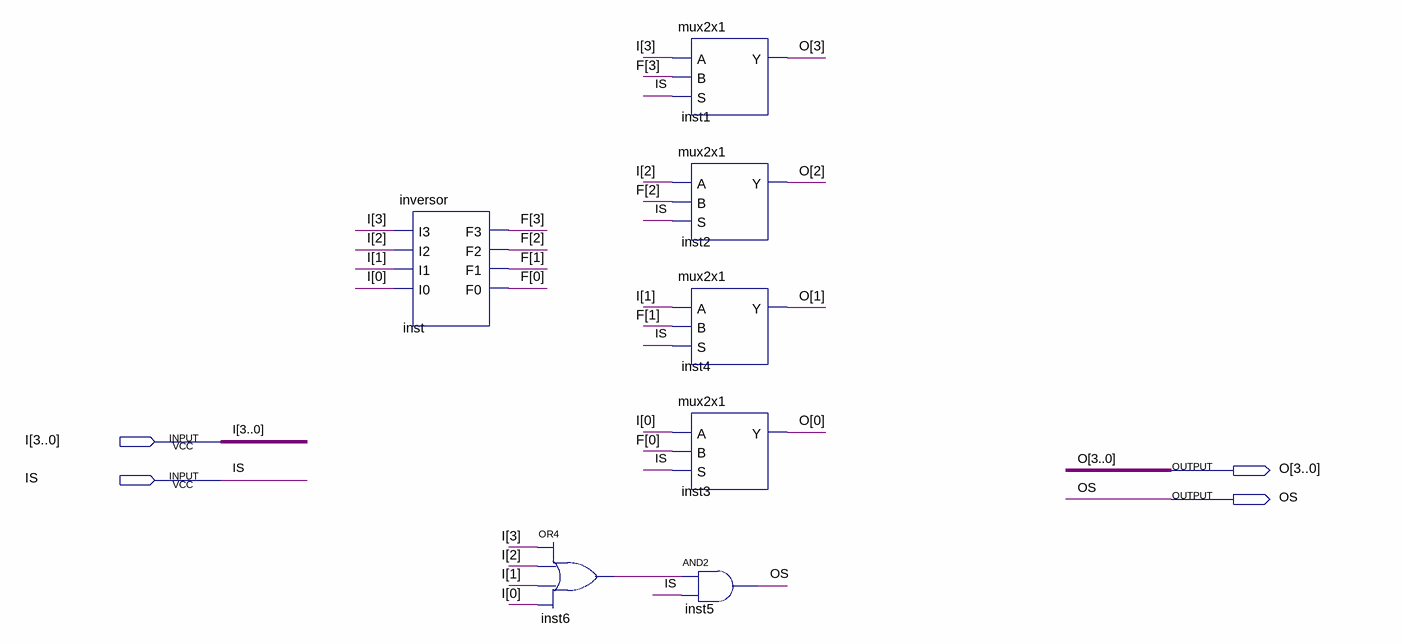
[diagram p0: schematic sheet]
// Quartus schematic comp2.bdf as structural Verilog: 7 symbols, 4 pins
module comp2 (
  input  [3:0] I,
  input  IS,
  output [3:0] O,
  output OS
);

  wire inst6_out;
  wire [3:0] F;

  inversor inst (.I3(I[3]), .I2(I[2]), .I1(I[1]), .I0(I[0]), .F3(F[3]), .F2(F[2]), .F1(F[1]), .F0(F[0]));
  or inst6 (inst6_out, I[3], I[2], I[1], I[0]);
  mux2x1 inst1 (.A(I[3]), .B(F[3]), .S(IS), .Y(O[3]));
  mux2x1 inst2 (.A(I[2]), .B(F[2]), .S(IS), .Y(O[2]));
  mux2x1 inst4 (.A(I[1]), .B(F[1]), .S(IS), .Y(O[1]));
  mux2x1 inst3 (.A(I[0]), .B(F[0]), .S(IS), .Y(O[0]));
  and inst5 (OS, inst6_out, IS);
endmodule
